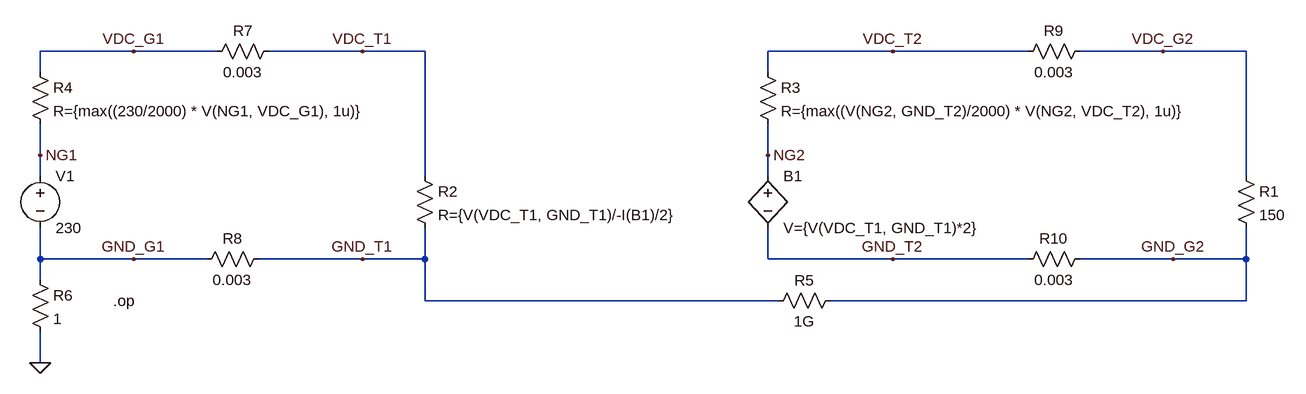
[diagram p0: schematic Transformer.asc]
Transformer.asc, the LTspice schematic file:
Version 4
SHEET 1 1460 680
WIRE -320 -80 -464 -80
WIRE -192 -80 -320 -80
WIRE 32 -80 -112 -80
WIRE 128 -80 32 -80
WIRE 848 -80 656 -80
WIRE 1056 -80 848 -80
WIRE 1264 -80 1136 -80
WIRE 1392 -80 1264 -80
WIRE -464 -48 -464 -80
WIRE 656 -48 656 -80
WIRE -464 80 -464 32
WIRE 656 80 656 32
WIRE -464 112 -464 80
WIRE 128 112 128 -80
WIRE 656 112 656 80
WIRE 1392 112 1392 -80
WIRE -464 240 -464 192
WIRE -320 240 -464 240
WIRE -208 240 -320 240
WIRE 32 240 -128 240
WIRE 128 240 128 192
WIRE 128 240 32 240
WIRE 656 240 656 192
WIRE 848 240 656 240
WIRE 1056 240 848 240
WIRE 1280 240 1136 240
WIRE 1392 240 1392 192
WIRE 1392 240 1280 240
WIRE -464 272 -464 240
WIRE 128 304 128 240
WIRE 672 304 128 304
WIRE 1392 304 1392 240
WIRE 1392 304 752 304
WIRE -464 400 -464 352
FLAG -464 400 0
FLAG -320 -80 VDC_G1
FLAG -320 240 GND_G1
FLAG 848 -80 VDC_T2
FLAG 848 240 GND_T2
FLAG -464 80 NG1
FLAG 656 80 NG2
FLAG 32 -80 VDC_T1
FLAG 32 240 GND_T1
FLAG 1264 -80 VDC_G2
FLAG 1280 240 GND_G2
SYMBOL voltage -464 96 R0
SYMATTR InstName V1
SYMATTR Value 230
SYMBOL res 1376 96 R0
SYMATTR InstName R1
SYMATTR Value 150
SYMBOL res 112 96 R0
SYMATTR InstName R2
SYMATTR Value R={V(VDC_T1, GND_T1)/-I(B1)/2}
SYMBOL res -480 -64 R0
SYMATTR InstName R4
SYMATTR Value R={max((230/2000) * V(NG1, VDC_G1), 1u)}
SYMBOL res 768 288 R90
WINDOW 0 0 56 VBottom 2
WINDOW 3 32 56 VTop 2
SYMATTR InstName R5
SYMATTR Value 1G
SYMBOL res -480 256 R0
SYMATTR InstName R6
SYMATTR Value 1
SYMBOL bv 656 96 R0
SYMATTR InstName B1
SYMATTR Value V={V(VDC_T1, GND_T1)*2}
SYMBOL res 640 -64 R0
SYMATTR InstName R3
SYMATTR Value R={max((V(NG2, GND_T2)/2000) * V(NG2, VDC_T2), 1u)}
SYMBOL res -208 -64 R270
WINDOW 0 32 56 VTop 2
WINDOW 3 0 56 VBottom 2
SYMATTR InstName R7
SYMATTR Value 0.003
SYMBOL res -224 256 R270
WINDOW 0 32 56 VTop 2
WINDOW 3 0 56 VBottom 2
SYMATTR InstName R8
SYMATTR Value 0.003
SYMBOL res 1040 -64 R270
WINDOW 0 32 56 VTop 2
WINDOW 3 0 56 VBottom 2
SYMATTR InstName R9
SYMATTR Value 0.003
SYMBOL res 1040 256 R270
WINDOW 0 32 56 VTop 2
WINDOW 3 0 56 VBottom 2
SYMATTR InstName R10
SYMATTR Value 0.003
TEXT -352 304 Left 2 !.op

The netlist it stands for:
* Transformer.asc
V1 NG1 GND_G1 230
R1 VDC_G2 GND_G2 150
R2 VDC_T1 GND_T1 R={V(VDC_T1, GND_T1)/-I(B1)/2}
R4 VDC_G1 NG1 R={max((230/2000) * V(NG1, VDC_G1), 1u)}
R5 GND_G2 GND_T1 1G
R6 GND_G1 0 1
B1 NG2 GND_T2 V={V(VDC_T1, GND_T1)*2}
R3 VDC_T2 NG2 R={max((V(NG2, GND_T2)/2000) * V(NG2, VDC_T2), 1u)}
R7 VDC_G1 VDC_T1 0.003
R8 GND_G1 GND_T1 0.003
R9 VDC_T2 VDC_G2 0.003
R10 GND_T2 GND_G2 0.003
.op
.backanno
.end